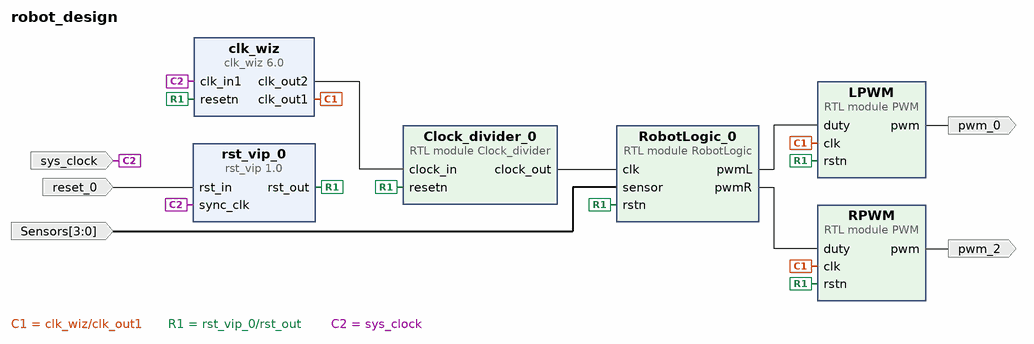
[diagram p0: block diagram of the top level]
# Vivado block design robot_design, xc7a100tcsg324-1, Vivado 2023.1
create_bd_design robot_design

create_bd_port -dir I -type rst reset_0
set_property -dict {CONFIG.POLARITY ACTIVE_LOW} [get_bd_ports reset_0]
create_bd_port -dir O pwm_0
create_bd_port -dir O pwm_2
create_bd_port -dir I -from 3 -to 0 Sensors
create_bd_port -dir I -type clk sys_clock
set_property -dict {CONFIG.FREQ_HZ 100000000 CONFIG.PHASE 0.0} [get_bd_ports sys_clock]

create_bd_cell -type module -reference Clock_divider Clock_divider_0
set_property -dict {CONFIG.DIVISOR 0x0061A80 CONFIG.DIVISOR_PER_2 0x0030D40} [get_bd_cells Clock_divider_0]
create_bd_cell -type ip -vlnv xilinx.com:ip:rst_vip:1.0 rst_vip_0
set_property -dict {CONFIG.ASYNCHRONOUS NO CONFIG.INTERFACE_MODE PASS_THROUGH} [get_bd_cells rst_vip_0]
create_bd_cell -type module -reference PWM LPWM
set_property -dict {CONFIG.ARR 255 CONFIG.PSC 1000} [get_bd_cells LPWM]
create_bd_cell -type module -reference PWM RPWM
set_property -dict {CONFIG.ARR 255 CONFIG.PSC 1000} [get_bd_cells RPWM]
create_bd_cell -type ip -vlnv xilinx.com:ip:clk_wiz:6.0 clk_wiz
set_property -dict [list \
  CONFIG.CLKOUT1_JITTER 130.958 \
  CONFIG.CLKOUT1_PHASE_ERROR 98.575 \
  CONFIG.CLKOUT2_JITTER 159.371 \
  CONFIG.CLKOUT2_PHASE_ERROR 98.575 \
  CONFIG.CLKOUT2_REQUESTED_OUT_FREQ 40 \
  CONFIG.CLKOUT2_USED true \
  CONFIG.CLK_IN1_BOARD_INTERFACE sys_clock \
  CONFIG.MMCM_CLKFBOUT_MULT_F 10.000 \
  CONFIG.MMCM_CLKOUT0_DIVIDE_F 10.000 \
  CONFIG.MMCM_CLKOUT1_DIVIDE 25 \
  CONFIG.NUM_OUT_CLKS 2 \
  CONFIG.RESET_BOARD_INTERFACE reset \
  CONFIG.RESET_PORT resetn \
  CONFIG.RESET_TYPE ACTIVE_LOW \
  CONFIG.USE_BOARD_FLOW true \
] [get_bd_cells clk_wiz]
create_bd_cell -type module -reference RobotLogic RobotLogic_0

# ---- connections ----

connect_bd_net [get_bd_pins Clock_divider_0/clock_out] [get_bd_pins RobotLogic_0/clk]
connect_bd_net -net PWM_0_pwm [get_bd_pins LPWM/pwm] [get_bd_ports pwm_0]
connect_bd_net -net PWM_2_pwm [get_bd_pins RPWM/pwm] [get_bd_ports pwm_2]
connect_bd_net [get_bd_pins RobotLogic_0/pwmL] [get_bd_pins LPWM/duty]
connect_bd_net [get_bd_pins RobotLogic_0/pwmR] [get_bd_pins RPWM/duty]
connect_bd_net [get_bd_ports Sensors] [get_bd_pins RobotLogic_0/sensor]
connect_bd_net [get_bd_pins clk_wiz/clk_out1] [get_bd_pins LPWM/clk] [get_bd_pins RPWM/clk]
connect_bd_net [get_bd_pins clk_wiz/clk_out2] [get_bd_pins Clock_divider_0/clock_in]
connect_bd_net -net reset_0_1 [get_bd_ports reset_0] [get_bd_pins rst_vip_0/rst_in]
connect_bd_net -net sim_clk_gen_0_sync_rst [get_bd_pins rst_vip_0/rst_out] \
  [get_bd_pins Clock_divider_0/resetn] [get_bd_pins LPWM/rstn] [get_bd_pins RPWM/rstn] [get_bd_pins clk_wiz/resetn] \
  [get_bd_pins RobotLogic_0/rstn]
connect_bd_net [get_bd_ports sys_clock] [get_bd_pins rst_vip_0/sync_clk] [get_bd_pins clk_wiz/clk_in1]

set_property USER_COMMENTS.comment_0 {// 0: right, 1: middle, 2: left} [get_bd_cells /Sensors]

validate_bd_design
save_bd_design
